# EAGLE design Relaya_the second Version 2 (EAGLE 9.1.2)
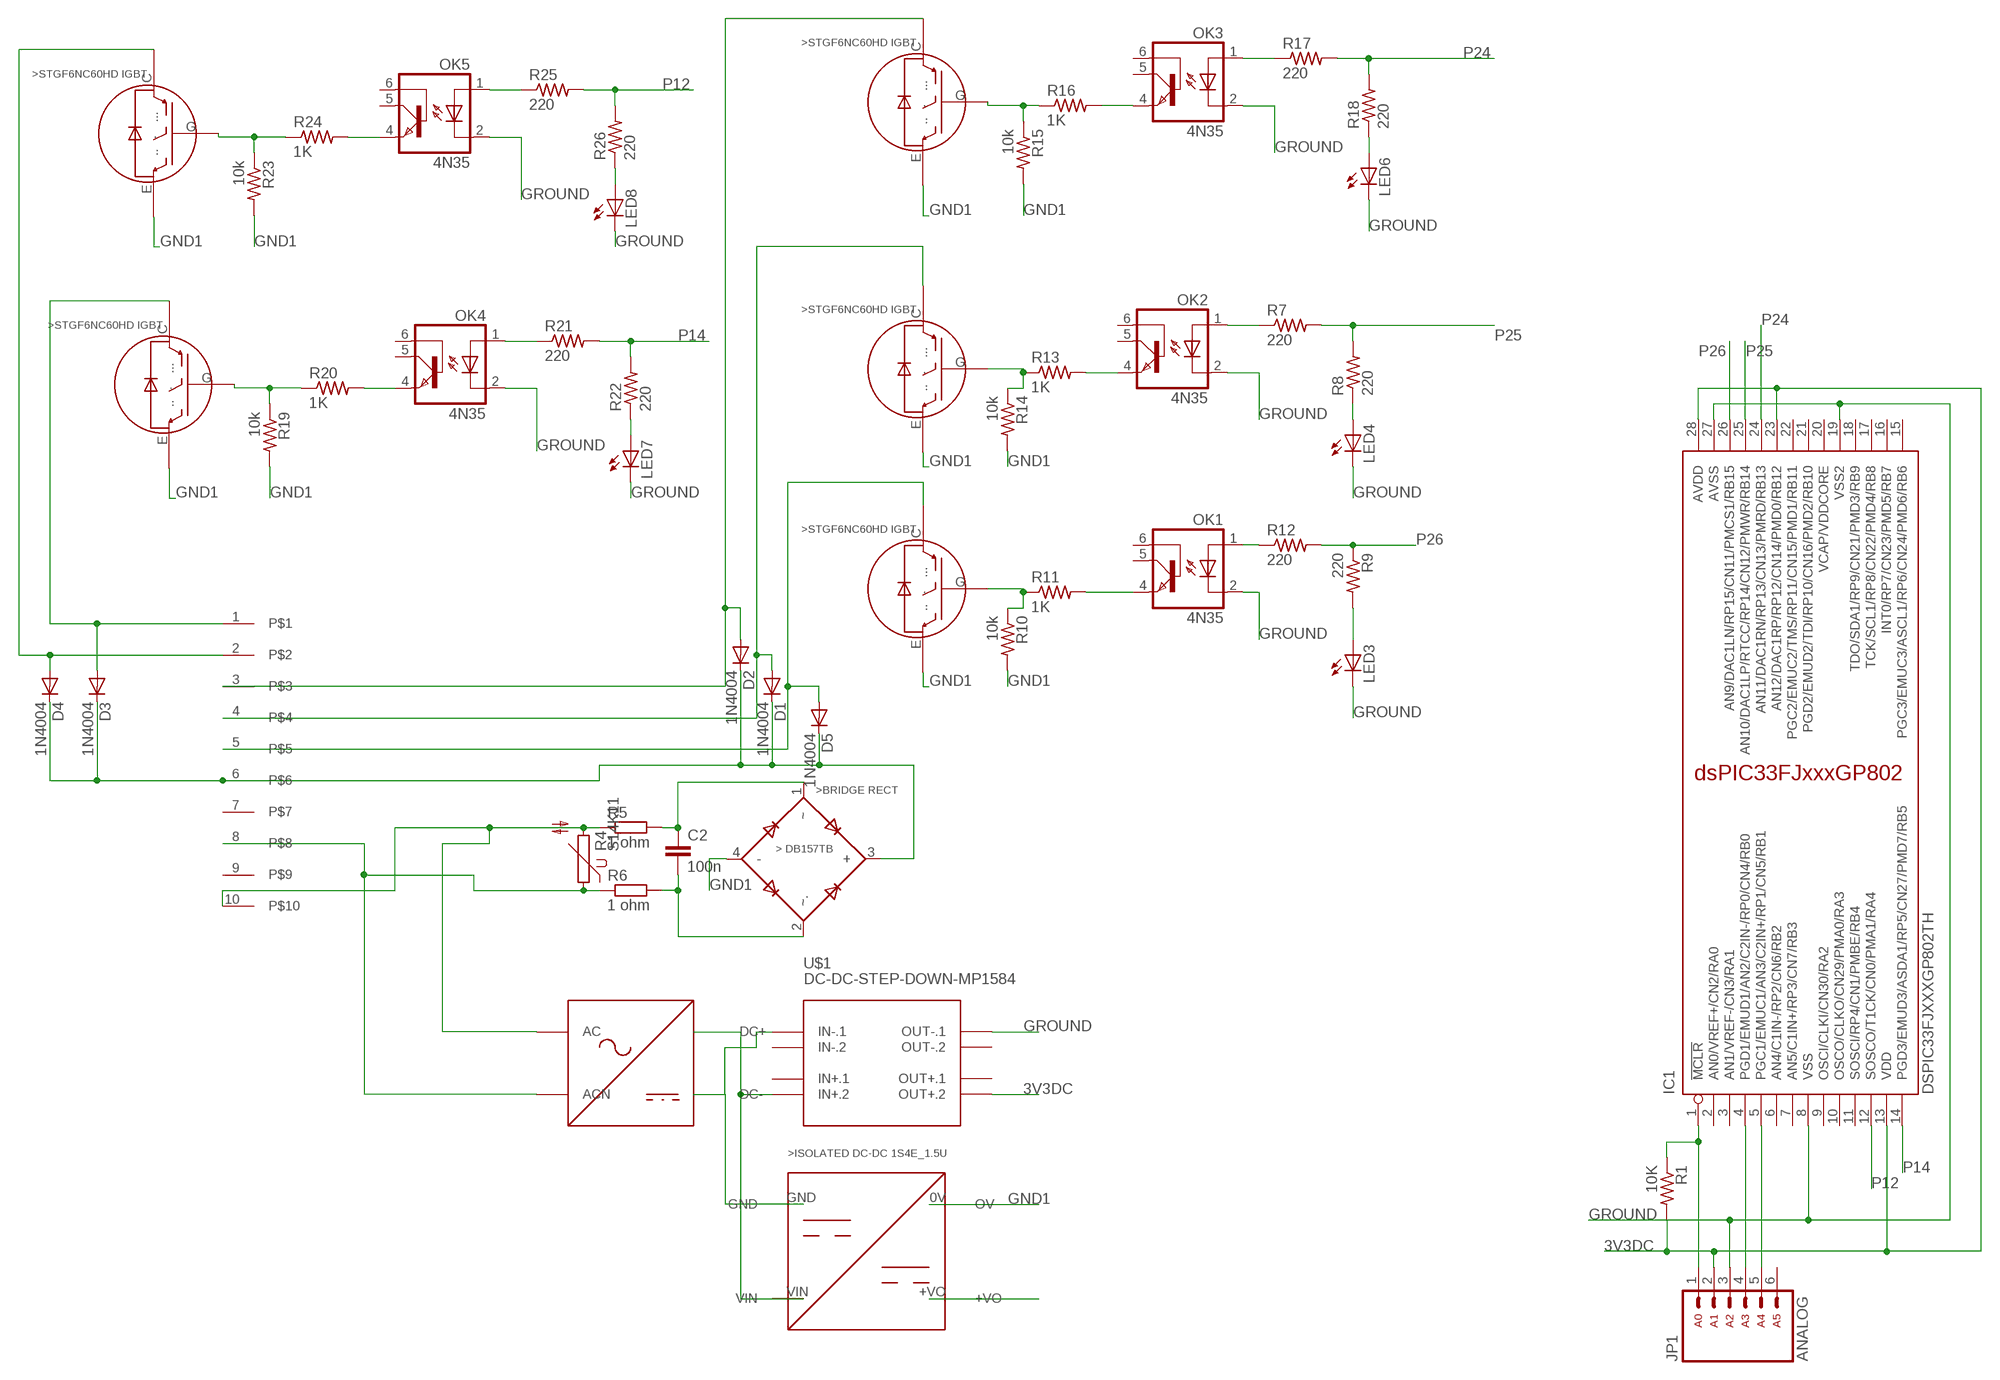
[diagram p0: schematic, sheet 1]

## Parts
ASD1  MY_LIBRAY_RPD10W1S  [MY_LIBRAY_2343]
C2  100n  C10/5  [C10B5]
D1  1N4004  [DO41-10]
D2  1N4004  [DO41-10]
D3  1N4004  [DO41-10]
D4  1N4004  [DO41-10]
D5  1N4004  [DO41-10]
IC1  DSPIC33FJXXXGP802TH  [DIL28-3]
JP1  ARDUINO_CONN-ANALOGSIP  [CONN-1X06]
LED3  LED5MM  [LED5MM]
LED4  LED5MM  [LED5MM]
LED6  LED5MM  [LED5MM]
LED7  LED5MM  [LED5MM]
LED8  LED5MM  [LED5MM]
OK1  4N35  [DIL06]
OK2  4N35  [DIL06]
OK3  4N35  [DIL06]
OK4  4N35  [DIL06]
OK5  4N35  [DIL06]
R1  10K  R-US_0207/10  [0207/10]
R4  S14K11  [S14K11]
R5  1 ohm  R-EU_0617/17  [0617/17]
R6  1 ohm  R-EU_0617/17  [0617/17]
R7  220  R-US_0207/10  [0207/10]
R8  220  R-US_0207/10  [0207/10]
R9  220  R-US_0207/10  [0207/10]
R10  10k  R-US_0207/10  [0207/10]
R11  1K  R-US_0207/10  [0207/10]
R12  220  R-US_0207/10  [0207/10]
R13  1K  R-US_0207/10  [0207/10]
R14  10k  R-US_0207/10  [0207/10]
R15  10k  R-US_0207/10  [0207/10]
R16  1K  R-US_0207/10  [0207/10]
R17  220  R-US_0207/10  [0207/10]
R18  220  R-US_0207/10  [0207/10]
R19  10k  R-US_0207/10  [0207/10]
R20  1K  R-US_0207/10  [0207/10]
R21  220  R-US_0207/10  [0207/10]
R22  220  R-US_0207/10  [0207/10]
R23  10k  R-US_0207/10  [0207/10]
R24  1K  R-US_0207/10  [0207/10]
R25  220  R-US_0207/10  [0207/10]
R26  220  R-US_0207/10  [0207/10]
U$1  DC-DC-STEP-DOWN-MP1584  [DC-DC-STEP-DOWN-MP1584]
U$2  AIRSEP_POWER_CONNECTOR  [JST-XH-CONNECTORS-GHII_JST-XH-10-PACKAGE-ROUND-PAD]
U$3  1S4E_1.5UA  [1S4E_1.5U]
U$4  IGBT_STGF6NC60HDA  [STGF6NC60HD]
U$5  BRIDGE_RECT_DB157TBA  [DB157TB]
U$6  IGBT_STGF6NC60HDA  [STGF6NC60HD]
U$7  IGBT_STGF6NC60HDA  [STGF6NC60HD]
U$8  IGBT_STGF6NC60HDA  [STGF6NC60HD]
U$9  IGBT_STGF6NC60HDA  [STGF6NC60HD]

## Nets
3V3DC [Power]: IC1.13(VDD) IC1.23(AN12/DAC1RP/RP12/CN14/PMD0/RB12) IC1.28(AVDD) JP1.2 R1.2 U$1.OUT+.2
AC__IN: ASD1.AC R4.2 R5.1 U$2.10
AC_IN: ASD1.ACN R4.1 R6.1 U$2.8
GND1 [Power]: R10.2 R14.2 R15.2 R19.2 R23.2 U$3.0V(OV) U$4.E(..) U$5.4(-) U$6.E(..) U$7.E(..) U$8.E(..) U$9.E(..)
GROUND [Power]: IC1.8(VSS) IC1.19(VSS2) IC1.27(AVSS) JP1.3 LED3.K(C) LED4.K(C) LED6.K(C) LED7.K(C) LED8.K(C) OK1.2(C) OK2.2(C) OK3.2(C) OK4.2(C) OK5.2(C) U$1.OUT-.1
N$1 [Power]: U$3.+VO
N$3 [Power]: OK1.4(EMI) R11.2
N$4 [Power]: C2.1 R5.2 U$5.1(~)
N$5 [Power]: C2.2 R6.2 U$5.2(~.)
N$6 [Power]: R10.1 R11.1 U$4.G(.)
N$7 [Power]: OK1.1(A) R12.1
N$9 [Power]: LED3.A R9.2
N$10 [Power]: R13.1 R14.1 U$6.G(.)
N$11 [Power]: OK2.1(A) R7.1
N$12 [Power]: OK2.4(EMI) R13.2
N$15 [Power]: LED4.A R8.1
N$16 [Power]: OK3.4(EMI) R16.2
N$17 [Power]: R15.1 R16.1 U$7.G(.)
N$18 [Power]: R19.1 R20.1 U$8.G(.)
N$19 [Power]: OK3.1(A) R17.1
N$21 [Power]: LED6.A R18.1
N$22 [Power]: OK4.4(EMI) R20.2
N$23 [Power]: OK4.1(A) R21.1
N$25 [Power]: LED7.A R22.1
N$26 [Power]: R23.1 R24.1 U$9.G(.)
N$27 [Power]: OK5.4(EMI) R24.2
N$28 [Power]: OK5.1(A) R25.1
N$30 [Power]: LED8.A R26.1
N$31 [Power]: D3.A U$2.1 U$8.C(...)
N$32 [Power]: ASD1.DC+ U$1.IN+.2 U$3.VIN
N$33 [Power]: ASD1.DC- U$1.IN-.1 U$3.GND
N$34 [Power]: D4.A U$2.2 U$9.C(...)
N$35 [Power]: D2.A U$2.3 U$7.C(...)
N$36 [Power]: D1.A U$2.4 U$6.C(...)
N$37 [Power]: D5.A U$2.5 U$4.C(...)
N$38 [Power]: D1.C D2.C D3.C D4.C D5.C U$2.6 U$5.3(+)
N$39 [Power]: IC1.5(PGC1/EMUC1/AN3/C2IN+/RP1/CN5/RB1) JP1.5
N$40 [Power]: IC1.4(PGD1/EMUD1/AN2/C2IN-/RP0/CN4/RB0) JP1.4
N$41 [Power]: IC1.1(!MCLR) JP1.1 R1.1
P12 [Power]: IC1.12(SOSCO/T1CK/CN0/PMA1/RA4) R25.2 R26.2
P14 [Power]: IC1.14(PGD3/EMUD3/ASDA1/RP5/CN27/PMD7/RB5) R21.2 R22.2
P24 [Power]: IC1.24(AN11/DAC1RN/RP13/CN13/PMRD/RB13) R17.2 R18.2
P25 [Power]: IC1.25(AN10/DAC1LP/RTCC/RP14/CN12/PMWR/RB14) R7.2 R8.2
P26 [Power]: IC1.26(AN9/DAC1LN/RP15/CN11/PMCS1/RB15) R9.1 R12.2
Unconnected: IC1.2(AN0/VREF+/CN2/RA0) IC1.3(AN1/VREF-/CN3/RA1) IC1.6(AN4/C1IN-/RP2/CN6/RB2) IC1.7(AN5/C1IN+/RP3/CN7/RB3) IC1.9(OSCI/CLKI/CN30/RA2) IC1.10(OSCO/CLKO/CN29/PMA0/RA3) IC1.11(SOSCI/RP4/CN1/PMBE/RB4) IC1.15(PGC3/EMUC3/ASCL1/RP6/CN24/PMD6/RB6) IC1.16(INT0/RP7/CN23/PMD5/RB7) IC1.17(TCK/SCL1/RP8/CN22/PMD4/RB8) IC1.18(TDO/SDA1/RP9/CN21/PMD3/RB9) IC1.21(PGD2/EMUD2/TDI/RP10/CN16/PMD2/RB10) IC1.22(PGC2/EMUC2/TMS/RP11/CN15/PMD1/RB11) JP1.6 OK1.5(COL) OK1.6(BAS) OK2.5(COL) OK2.6(BAS) OK3.5(COL) OK3.6(BAS) OK4.5(COL) OK4.6(BAS) OK5.5(COL) OK5.6(BAS) U$1.IN+.1 U$1.IN-.2 U$1.OUT+.1 U$1.OUT-.2 U$2.7 U$2.9

## Power pins joined to a net without a drawn wire
VCAP/VDDCORE: IC1.20(VCAP/VDDCORE)

## Library data of the parts
ASD1 = ACDC:MY_LIBRAY_RPD10W1S
C2 = capacitor-wima:C: CAPACITOR naming: grid - package width
D1-D5 = adafruit:1N4004: DIODE General purpose 1N400x type rectifier (With bigger pads) http://www.ladyada.net/library/pcb/eaglelibrary.html
IC1 = microchip-dspic33:DSPIC33FJXXXGP802: High-Performance, 16-bit Digital Signal Controllers - dsPIC33FJ64GP802 & dsPIC33FJ128GP802 Source: http://ww1.microchip.com/downloads/en/DeviceDoc/70292B.pdf Operating Range: . Up to 40 MIPS operation (at 3.0-3.6V): - Industrial temperature range (-40°C to +85°C) - Extended temperature range (-40°C to +125°C) High-Performance DSC CPU: . Modified Harvard architecture . C compiler optimized instruction set . 16-bit wide data path . 24-bit wide instructions . Linear program memory addressing up to 4M instruction words . Linear data memory addressing up to 64 Kbytes . 83 base instructions: mostly 1 word/1 cycle . Two 40-bit accumulators with rounding and saturation options . Flexible and powerful addressing modes: - Indirect - Modulo - Bit-Reversed . Software stack . 16 x 16 fractional/integer multiply operations . 32/16 and 16/16 divide operations . Single-cycle multiply and accumulate: - Accumulator write back for DSP operations - Dual data fetch . Up to ±16-bit shifts for up to 40-bit data On-Chip Flash and SRAM: . Flash program memory . Data SRAM . Boot, Secure, and General Security for program Flash Direct Memory Access (DMA): . 8-channel hardware DMA . Up to 2 Kbytes dual ported DMA buffer area (DMA RAM) to store data transferred via DMA: - Allows data transfer between RAM and a peripheral while CPU is executing code (no cycle stealing) . Most peripherals support DMA Timers/Capture/Compare/PWM: . Timer/Counters, up to five 16-bit timers: - Can pair up to make two 32-bit timers - One timer runs as a Real-Time Clock with an external 32.768 kHz oscillator - Programmable prescaler . Input Capture (up to four channels): - Capture on up, down or both edges - 16-bit capture input functions - 4-deep FIFO on each capture . Output Compare (up to four channels): - Single or Dual 16-bit Compare mode - 16-bit Glitchless PWM mode . Hardware Real-Time Clock/Calendar (RTCC): - Provides clock, calendar, and alarm functions Interrupt Controller: . 5-cycle latency . 118 interrupt vectors . Up to 49 available interrupt sources . Up to three external interrupts . Seven programmable priority levels . Five processor exceptions Digital I/O: . Peripheral pin Select functionality . Up to 35 programmable digital I/O pins . Wake-up/Interrupt-on-Change for up to 21 pins . Output pins can drive from 3.0V to 3.6V . Up to 5V output with open drain configuration . All digital input pins are 5V tolerant . 4 mA sink on all I/O pins System Management: . Flexible clock options: - External, crystal, resonator, internal RC - Fully integrated Phase-Locked Loop (PLL) - Extremely low jitter PLL . Power-up Timer . Oscillator Start-up Timer/Stabilizer . Watchdog Timer with its own RC oscillator . Fail-Safe Clock Monitor . Reset by multiple sources Power Management: . On-chip 2.5V voltage regulator . Switch between clock sources in real time . Idle, Sleep, and Doze modes with fast wake-up Analog-to-Digital Converters (ADCs): . 10-bit, 1.1 Msps or 12-bit, 500 Ksps conversion: - Two and four simultaneous samples (10-bit ADC) - Up to 13 input channels with auto-scanning - Conversion start can be manual or synchronized with one of four trigger sources - Conversion possible in Sleep mode - ±2 LSb max integral nonlinearity - ±1 LSb max differential nonlinearity Audio Digital-to-Analog Converter (DAC): . 16-bit Dual Channel DAC module . 100 Ksps maximum sampling rate . Second-Order Digital Delta-Sigma Modulator Data Converter Interface (DCI) module: . Codec interface . Supports I2S and AC.97 protocols . Up to 16-bit data words, up to 16 words per frame . 4-word deep TX and RX buffers Comparator Module: . Two analog comparators with programmable input/output configuration CMOS Flash Technology: . Low-power, high-speed Flash technology . Fully static design . 3.3V (±10%) operating voltage . Industrial and Extended temperature . Low power consumption Communication Modules: . 4-wire SPI (up to two modules): - Framing supports I/O interface to simple codecs - Supports 8-bit and 16-bit data - Supports all serial clock formats and sampling modes . I2C?: - Full Multi-Master Slave mode support - 7-bit and 10-bit addressing - Bus collision detection and arbitration - Integrated signal conditioning - Slave address masking . UART (up to two modules): - Interrupt on address bit detect - Interrupt on UART error - Wake-up on Start bit from Sleep mode - 4-character TX and RX FIFO buffers - LIN bus support - IrDA® encoding and decoding in hardware - High-Speed Baud mode - Hardware Flow Control with CTS and RTS . Enhanced CAN (ECAN. module) 2.0B active: - Up to eight transmit and up to 32 receive buffers - 16 receive filters and three masks - Loopback, Listen Only and Listen All - Messages modes for diagnostics and bus monitoring - Wake-up on CAN message - Automatic processing of Remote Transmission Requests - FIFO mode using DMA - DeviceNet. addressing support . Parallel Master Slave Port (PMP/EPSP): - Supports 8-bit or 16-bit data - Supports 16 address lines . Programmable Cyclic Redundancy Check (CRC): - Programmable bit length for the CRC generator polynomial (up to 16-bit length) - 8-deep, 16-bit or 16-deep, 8-bit FIFO for data input
JP1 = arduino_jw:ARDUINO_CONN-ANALOG: Arduino Analog I/O Header This is the analog I/O header on the Arduino Uno R3. This connector is labeled with the following pin assignments: Analog 0 Analog 1 Analog 2 Analog 3 Analog 4 Analog 5 NOTE: Be sure you install this connector with the correct orientation on your PCB layout. Pin 1 has a square pad to assist with orientation.
LED3 LED4 LED6-LED8 = led:LED: LED OSRAM: - CHIPLED LG R971, LG N971, LY N971, LG Q971, LY Q971, LO R971, LY R971 LH N974, LH R974 LS Q976, LO Q976, LY Q976 LO Q996 - Hyper CHIPLED LW Q18S LB Q993, LB Q99A, LB R99A - SideLED LS A670, LO A670, LY A670, LG A670, LP A670 LB A673, LV A673, LT A673, LW A673 LH A674 LY A675 LS A676, LA A676, LO A676, LY A676, LW A676 LS A679, LY A679, LG A679 - Hyper Micro SIDELED® LS Y876, LA Y876, LO Y876, LY Y876 LT Y87S - SmartLED LW L88C, LW L88S LB L89C, LB L89S, LG L890 LS L89K, LO L89K, LY L89K LS L896, LA L896, LO L896, LY L896 - TOPLED LS T670, LO T670, LY T670, LG T670, LP T670 LSG T670, LSP T670, LSY T670, LOP T670, LYG T670 LG T671, LOG T671, LSG T671 LB T673, LV T673, LT T673, LW T673 LH T674 LS T676, LA T676, LO T676, LY T676, LB T676, LH T676, LSB T676, LW T676 LB T67C, LV T67C, LT T67C, LS T67K, LO T67K, LY T67K, LW E67C LS E67B, LA E67B, LO E67B, LY E67B, LB E67C, LV E67C, LT E67C LW T67C LS T679, LY T679, LG T679 LS T770, LO T770, LY T770, LG T770, LP T770 LB T773, LV T773, LT T773, LW T773 LH T774 LS E675, LA E675, LY E675, LS T675 LS T776, LA T776, LO T776, LY T776, LB T776 LHGB T686 LT T68C, LB T68C - Hyper Mini TOPLED® LB M676 - Mini TOPLED Santana® LG M470 LS M47K, LO M47K, LY M47K Source: http://www.osram.convergy.de LUXEON: - LUMILED® LXK2-PW12-R00, LXK2-PW12-S00, LXK2-PW14-U00, LXK2-PW14-V00 LXK2-PM12-R00, LXK2-PM12-S00, LXK2-PM14-U00 LXK2-PE12-Q00, LXK2-PE12-R00, LXK2-PE12-S00, LXK2-PE14-T00, LXK2-PE14-U00 LXK2-PB12-K00, LXK2-PB12-L00, LXK2-PB12-M00, LXK2-PB14-N00, LXK2-PB14-P00, LXK2-PB14-Q00 LXK2-PR12-L00, LXK2-PR12-M00, LXK2-PR14-Q00, LXK2-PR14-R00 LXK2-PD12-Q00, LXK2-PD12-R00, LXK2-PD12-S00 LXK2-PH12-R00, LXK2-PH12-S00 LXK2-PL12-P00, LXK2-PL12-Q00, LXK2-PL12-R00 Source: www.luxeon.com KINGBRIGHT: KA-3528ASYC Source: www.kingbright.com
OK1-OK5 = optocoupler:4N35: MOTOROLA OPTO COUPLER; MF: FAIRCHILD SEMICONDUCTOR; MPN: 4N35; OC_FARNELL: 1328375; OC_NEWARK: 72K9946
R1 R7-R26 = resistor:R-US_: RESISTOR, American symbol
R4 = varistor:S14K11: VARISTOR
R5 R6 = rcl:R-EU_: RESISTOR, European symbol; SPICEPREFIX: R
U$1 = GHIdiy-modules:DC-DC-STEP-DOWN-MP1584: DC/DC Step-Down Regulator based on MP1584 chip MP1584 datasheet available here: http://www.haoyuelectronics.com/Attachment/MP1584/MP1584.pdf Click here to find device on ebay.com <http://www.ebay.com/sch/mp1584+module>
U$2 = Airsep_Power_Connector:AIRSEP_POWER_CONNECTOR
U$3 = GHII Isolated dc-dc 1S4E_1.5U:1S4E_1.5U
U$4 U$6-U$9 = GHII IGBT GF6NC60HD:IGBT_STGF6NC60HD: GHII IGBT
U$5 = BRIDGE RECTIFIER (DB157TB):BRIDGE_RECT_DB157TB

## Net classes
0 default: width 3 mm, drill 3 mm, clearance 0.762 mm
1 Power: width 1.3 mm, drill 1.3 mm, clearance 0.508 mm

## Board
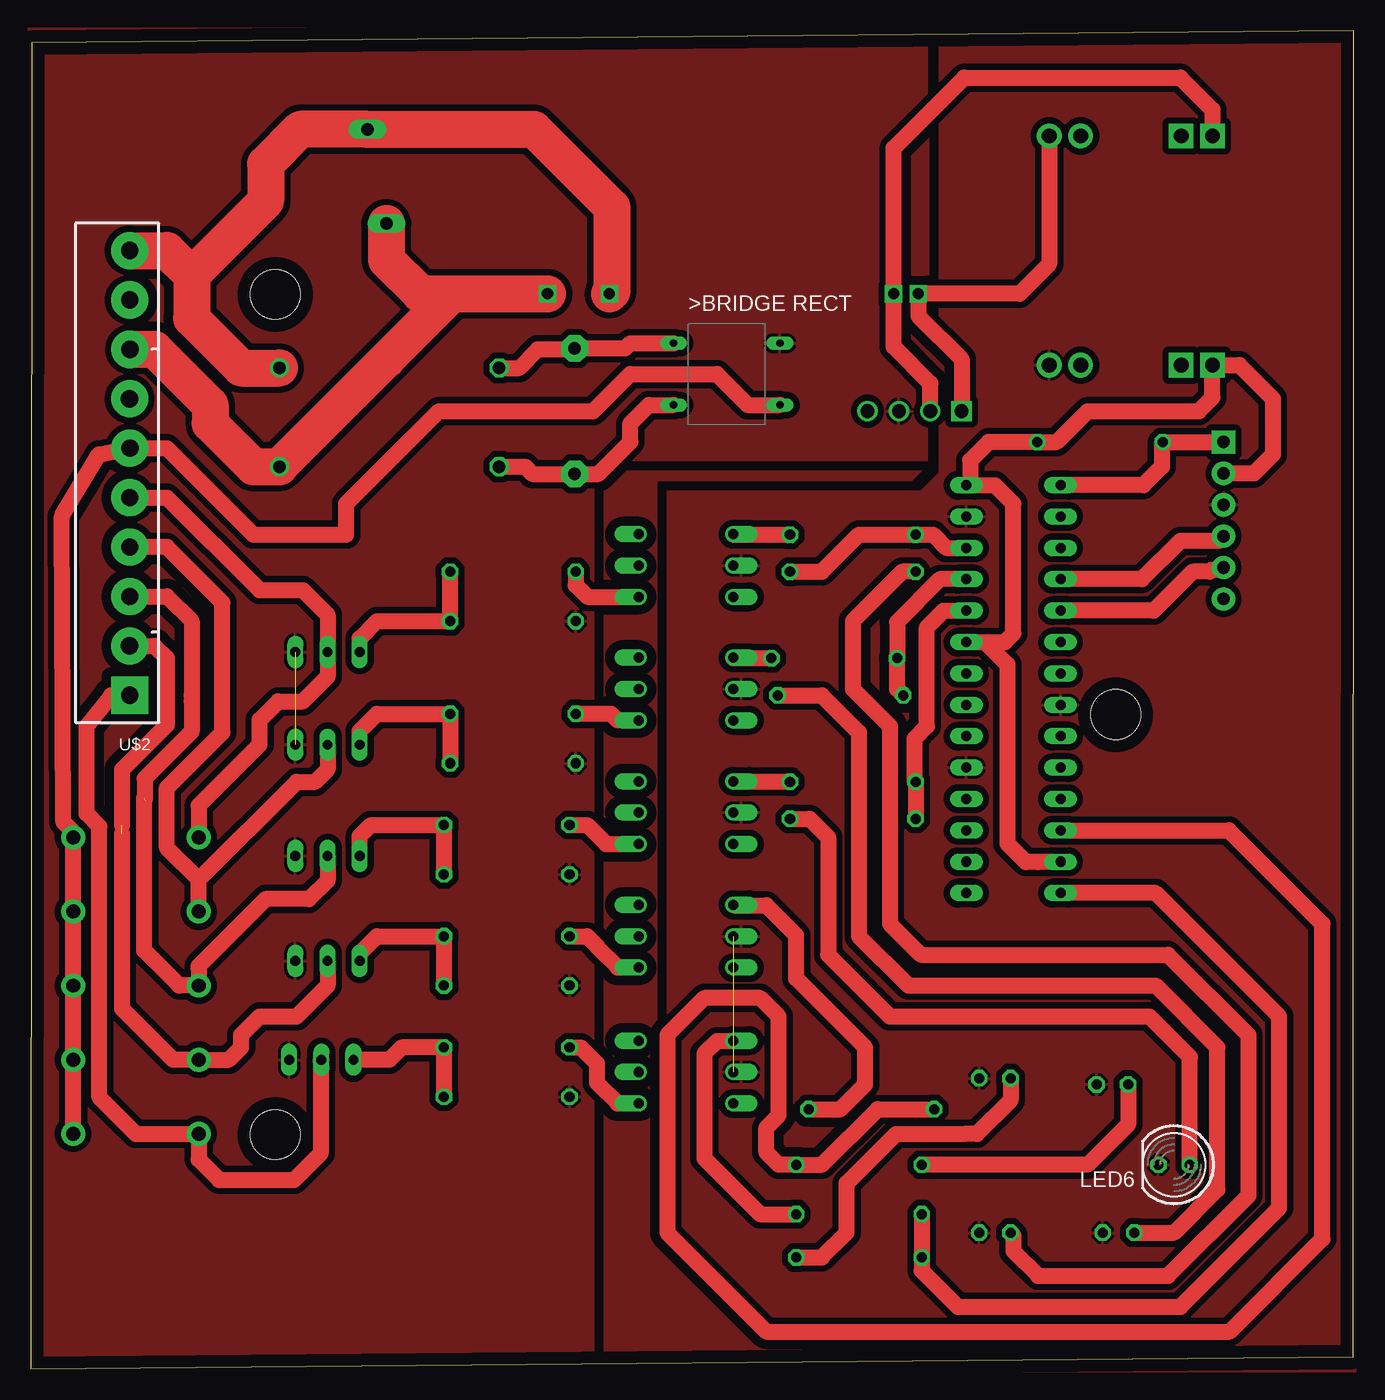
[diagram p1: board, top side]
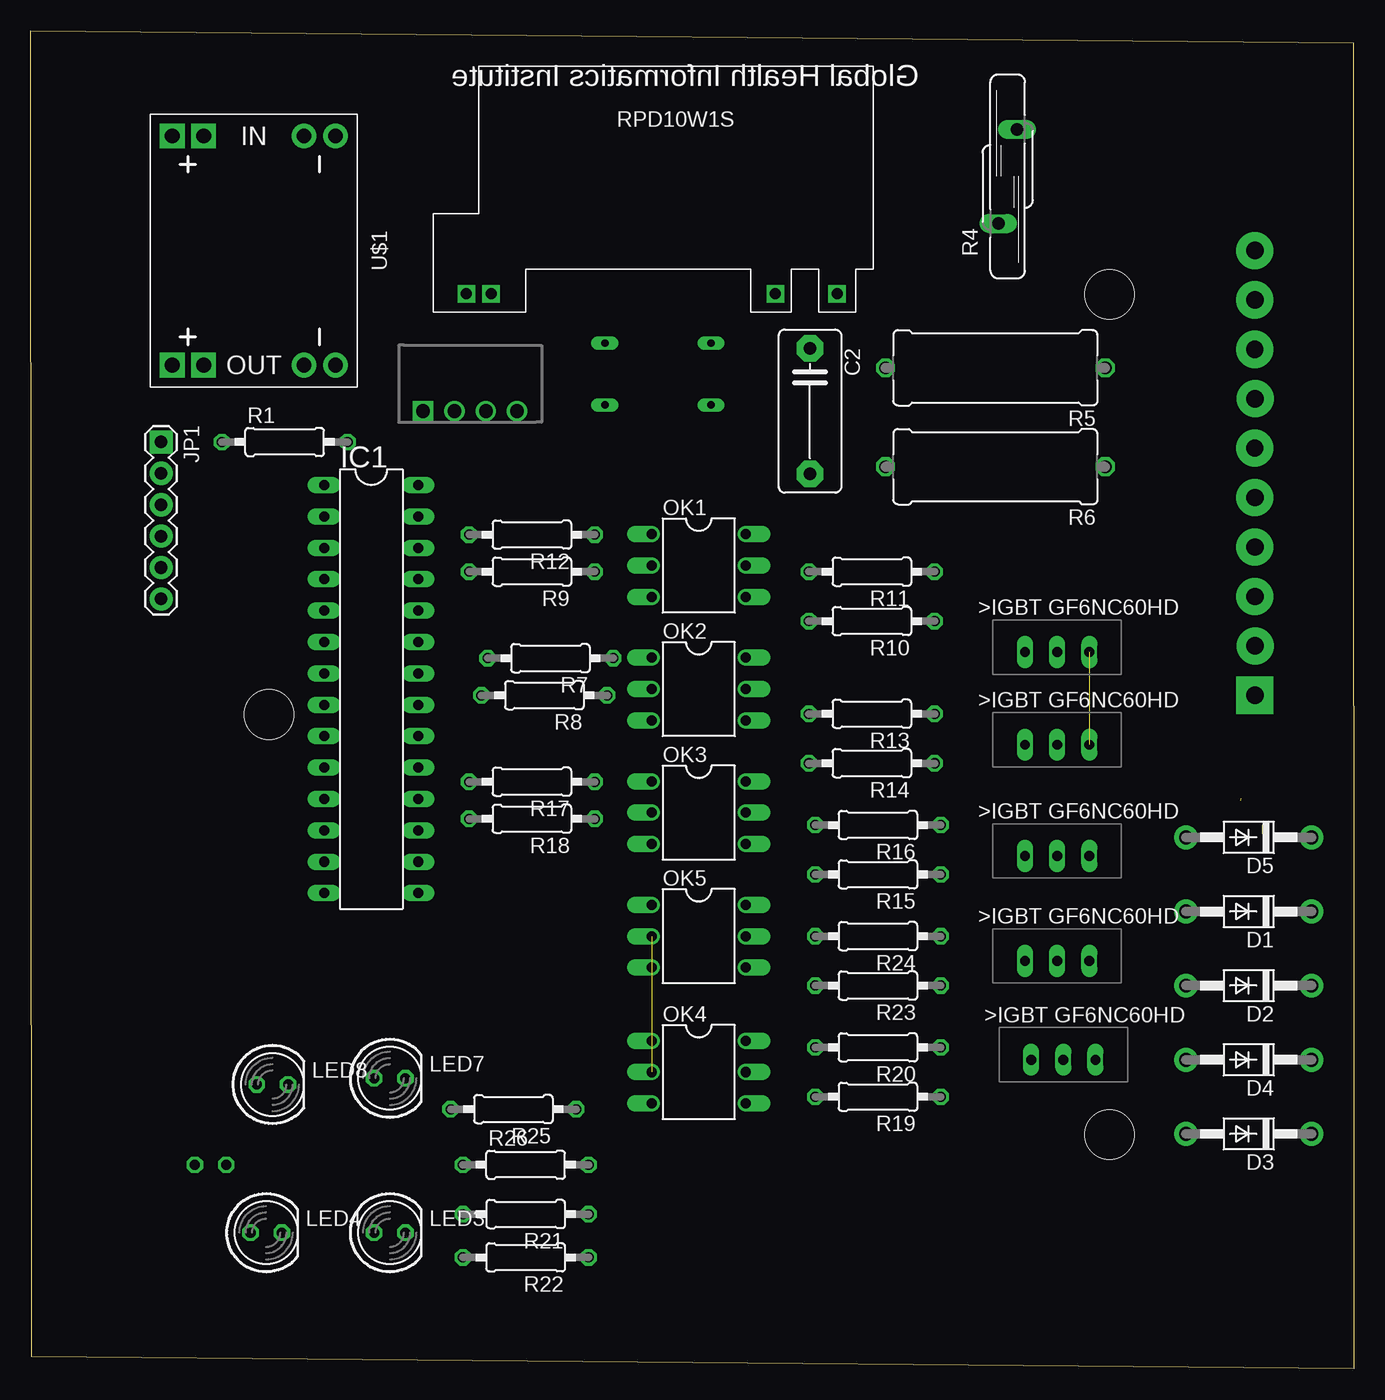
[diagram p2: board, bottom side, seen from below]

Size 107.04 x 108.28 mm. Coordinates in mm from the lower left corner, seen from the top.
Outline: 0,0 106.99,0.96 107.04,108.28 0.05,107.32 0,0
Copper layers (1*16): Top 0.035mm / dielectric 1.5mm / Bottom 0.035mm
Design rules "default": minimum track width 6mil, minimum drill 0.35mm, track to track 6mil, track to pad 6mil, pad to pad 6mil, via to via 6mil, smd to smd 6mil, copper to edge 40mil, drill to drill 6mil, minimum pad ring 10mil, minimum via ring 8mil, stop-mask expansion 4mil, vias tented up to drill 0mil, thermal gap 10mil
Holes 4 mm at 87.77,52.94 19.77,86.94 19.77,18.94

### Footprints (pad centres in the part's own frame; a part is rotated, then mirrored left to right if it is on the bottom)
MY_LIBRAY_2343 = drill 0.9 square: AC 2.7,-13.5; ACN 7.7,-13.5; DC+ -20.3,-13.5; DC- -22.3,-13.5
C10B5 = drill 1.016 pad 2.159 octagon: 1 -5.08,0; 2 5.08,0
DO41-10 = drill 1.118 pad 1.93: A 5.08,0; C -5.08,0
DIL28-3 = drill 0.813 long: 1 -16.51,-3.81; 2 -13.97,-3.81; 3 -11.43,-3.81; 4 -8.89,-3.81; 5 -6.35,-3.81; 6 -3.81,-3.81; 7 -1.27,-3.81; 8 1.27,-3.81; 9 3.81,-3.81; 10 6.35,-3.81; 11 8.89,-3.81; 12 11.43,-3.81; 13 13.97,-3.81; 14 16.51,-3.81; 15 16.51,3.81; 16 13.97,3.81; 17 11.43,3.81; 18 8.89,3.81; 19 6.35,3.81; 20 3.81,3.81; 21 1.27,3.81; 22 -1.27,3.81; 23 -3.81,3.81; 24 -6.35,3.81; 25 -8.89,3.81; 26 -11.43,3.81; 27 -13.97,3.81; 28 -16.51,3.81
CONN-1X06 = drill 1.016 pad 1.88 square: 1 0,0 | drill 1.016 pad 1.88: 2 2.54,0; 3 5.08,0; 4 7.62,0; 5 10.16,0; 6 12.7,0
LED5MM = drill 0.813 octagon: A -1.27,0; K 1.27,0
DIL06 = drill 0.813 offset: 1 -2.54,-3.81; 2 0,-3.81; 3 2.54,-3.81; 4 2.54,3.81; 5 0,3.81; 6 -2.54,3.81
0207/10 = drill 0.813 octagon: 1 -5.08,0; 2 5.08,0
S14K11 = drill 1.016 long: 1 -0.762,-3.81; 2 0.762,3.81
0617/17 = drill 1.016 octagon: 1 -8.89,0; 2 8.89,0
DC-DC-STEP-DOWN-MP1584 = drill 1.2 pad 2 square: IN+.1 -9.271,-4.064; IN+.2 -9.271,-6.604; OUT+.1 9.271,-4.064; OUT+.2 9.271,-6.604 | drill 1.2 pad 2: IN-.1 -9.271,6.604; IN-.2 -9.271,4.064; OUT-.1 9.271,6.604; OUT-.2 9.271,4.064
JST-XH-CONNECTORS-GHII_JST-XH-10-PACKAGE-ROUND-PAD = drill 1.4 pad 3 square: 1 -18.5,0 | drill 1.4 pad 3: 2 -14.5,0.01; 3 -10.5,0; 4 -6.5,0; 5 -2.5,0; 6 1.5,-0.01; 7 5.5,0.01; 8 9.5,-0.01; 9 13.5,0; 10 17.5,0
1S4E_1.5U = drill 1.1: 0V 1.27,0; +VO 3.81,0; VIN -1.27,0 | drill 1.1 square: GND -3.81,0
STGF6NC60HD = drill 0.8 long: C 0,0; E 2.6,0; G -2.6,0
DB157TB = drill 0.6 long: 1 0,0; 2 5,0; 3 5,8.6; 4 0,8.6

### Placement (x,y rotation side)
ASD1  49.5,100.5 0 bottom
C2  44,77.5 270 bottom
D1  8.5,37 180 bottom
D2  8.5,31 180 bottom
D3  8.5,19 180 bottom
D4  8.5,25 180 bottom
D5  8.5,43 180 bottom
IC1  79.5,55 270 bottom
JP1  96.5,75 270 bottom
LED3  78,11 0 bottom
LED4  88,11 0 bottom
LED6  92.5,16.5 180 top
LED7  78,23.5 0 bottom
LED8  87.5,23 0 bottom
OK1  53,65 270 bottom
OK2  53,55 270 bottom
OK3  53,45 270 bottom
OK4  53,24 270 bottom
OK5  53,35 270 bottom
R1  86.5,75 0 bottom
R4  28,96.5 0 bottom
R5  29,81 180 bottom
R6  29,73 180 bottom
R7  65,57.5 180 bottom
R8  65.5,54.5 180 bottom
R9  66.5,64.5 180 bottom
R10  39,60.5 180 bottom
R11  39,64.5 180 bottom
R12  66.5,67.5 180 bottom
R13  39,53 180 bottom
R14  39,49 180 bottom
R15  38.5,40 180 bottom
R16  38.5,44 180 bottom
R17  66.5,47.5 180 bottom
R18  66.5,44.5 180 bottom
R19  38.5,22 180 bottom
R20  38.5,26 180 bottom
R21  67,12.5 180 bottom
R22  67,9 180 bottom
R23  38.5,31 180 bottom
R24  38.5,35 180 bottom
R25  68,21 180 bottom
R26  67,16.5 0 bottom
U$1  89,90.5 270 bottom
U$2  8,73 90 top
U$3  71.5,77.5 0 bottom
U$4  24,58 0 bottom
U$5  52,83 270 top
U$6  24,50.5 0 bottom
U$7  24,41.5 0 bottom
U$8  23.5,25 0 bottom
U$9  24,33 0 bottom

### Tracks (layer width: path | path; a pad name or v marks a point on that pad's centre or on a via)
3V3DC
  Top 1.3: JP1.2 98.96,72.46 100.5,74 100.5,78.5 97.77,81.23 U$1.OUT+.2 95.6,78.6 94.5,77.5 85.5,77.5 83,75 R1.2 77.5,75 76,73.5 76,71.82 IC1.28 78,71.5 79.5,70 79.5,59.5 78.81,58.81 77.19,58.81 | IC1.13 81.53,41.03 81.5,41 80.5,41 79,42.5 79,57 77.19,58.81 | IC1.23 77.19,58.81
_OUTLINES_
  pour Top (isolate 0.025, rank 6): -0.27,-0.27 107.23,-0.27 107.23,108.47 -0.27,108.47
AC__IN
  Top 3: U$2.10 11,90.5 13,88.5 | 13,88.5 13,85 17,81 R5.1 | 13,88.5 19,94.5 19,97.5 21.81,100.31 R4.2 40.69,100.31 47,94 47,87.2 ASD1.AC
AC_IN
  Top 3: U$2.8 10,82.5 14.5,78 14.5,76.5 18,73 R6.1 28.76,81.65 34.11,87 | 34.11,87 ASD1.ACN | R4.1 28.76,89.74 31.5,87 34.11,87
GND1  (1 unrouted)
  pour Top: 0,108 72.5,108 72.5,73.5 45.5,73.5 45.5,0 0,0
GROUND  (1 unrouted)
  pour Top: 73.5,107.5 73.5,72.5 72,71 51.5,71 51.5,1.5 106.5,1.5 106.5,108 73.5,108
N$3
  Top 1.3: R11.2 44.08,63.42 45.04,62.46 OK1.4
N$4
  Top 1.3: R5.2 39.5,81 41,82.5 43.92,82.5 C2.1 48.08,82.58 48.5,83 U$5.1
N$5
  Top 1.3: R6.2 40,73 40.58,72.42 C2.2 45.92,72.42 48.5,75 48.5,76.5 50,78 U$5.2
N$6
  Top 1.3: U$4.G 26.6,59.1 28,60.5 R10.1 R11.1
N$7
  Top 1.3: OK1.1 56.85,67.5 R12.1
N$9
  Top 1.3: R9.2 70.5,64.5 66.5,60.5 66.5,55 69.5,52 69.5,36 72,33.5 92,33.5 98.5,27 98.5,14 92,7.5 81.5,7.5 79.5,9.5 79.5,10.77 LED3.A
N$10
  Top 1.3: U$6.G 26.6,51.6 28,53 R13.1 R14.1
N$11
  Top 1.3: OK2.1 56.85,57.5 R7.1
N$12
  Top 1.3: OK2.4 47.48,52.46 46.94,53 R13.2
N$15
  Top 1.3: R8.1 64,54.5 67,51.5 67,35 71,31 91,31 96,26 96,14.5 92.5,11 LED4.A
N$16
  Top 1.3: R16.2 45,44 46.54,42.46 OK3.4
N$17
  Top 1.3: U$7.G 26.6,43.1 27.5,44 R16.1 R15.1
N$18
  Top 1.3: U$8.G 29,25 30,26 R20.1 R19.1
N$19
  Top 1.3: OK3.1 61.38,47.54 R17.1
N$21
  Top 1.3: R18.1 63,44.5 64.5,43 64.5,33.5 69.5,28.5 75.94,28.5 76.5,28.5 90.5,28.5 93.77,25.23 LED6.A
N$22
  Top 1.3: R20.2 44.5,26 45.8,24.7 45.8,23.14 47.48,21.46 OK4.4
N$23
  Top 1.3: OK4.1 56.77,26.5 55.5,26.5 54.5,25.5 54.5,17 59,12.5 R21.1
N$25
  Top 1.3: R22.1 64,9 66,11 66,15 70,19 75.5,19 76.54,19 79.27,21.73 LED7.A
N$26
  Top 1.3: U$9.G 26.6,33.6 28,35 R24.1 R23.1
N$27
  Top 1.3: R24.2 45,35 45.8,34.2 45.8,34.14 47.48,32.46 OK5.4
N$28
  Top 1.3: OK5.1 56.85,37.5 59.5,37.5 61.92,35.08 61.92,31.58 67.5,26 67.5,23 65.5,21 R25.1
N$30
  Top 1.3: R26.1 85.5,16.5 88.77,19.77 LED8.A
N$31
  Top 1.3: U$2.1 6.5,54.5 4.5,52 4.5,44.92 5.54,43.88 5.54,21.96 8.5,19 D3.A 13.58,16.92 15.23,15.27 21.29,15.27 23.44,17.42 23.44,24.94 U$8.C
N$32
  Top 1.3: U$1.IN+.2 95.6,101.9 93,104.5 75.5,104.5 69.8,98.8 ASD1.DC+ 69.8,82.7 72.77,79.73 U$3.VIN
N$33
  Top 1.3: U$1.IN-.1 82.4,89.4 80,87 ASD1.DC- 71.8,85.2 75.31,81.69 U$3.GND
N$34  (1 unrouted)
  Top 1.3: 7.35,43.29 7.35,29.5 7.35,29.15 11.5,25 D4.A 16,25 17,26 17,27 18.5,28.5 21.5,28.5 24,31 U$9.C | U$2.2 10,58.5 11,57.5 11,52.11 7.35,48.47 7.35,44
N$35  (1 unrouted)
  Top 1.3: U$2.3 11,62.5 13,60.5 13,54.5 | 13,54.5 13,54 | 13.58,32.42 D2.A | U$7.C 24,39.5 22.5,38 19,38 13.58,32.58 D2.A | D2.A 12,31 9.16,33.84 9.16,46.16 | 13,54.5 13,51.56 9.19,47.75 9.19,46
N$36
  Top 1.3: U$6.C 24,48.5 23,47.5 21.5,47.5 13.58,39.58 | U$2.4 11,66.5 15.5,62 15.5,51.5 11,47 11,42.16 13.58,39.58 | D1.A 13.58,39.58
N$37
  Top 1.3: U$2.5 11,70.5 18.5,63 22,63 24,61 U$4.C 24,56 22,54 20,54 18.5,52.5 18.5,50.5 13.58,45.58 D5.A
N$38
  Top 1.3: U$5.3 58,78 55.5,80.5 48.5,80.5 45.5,77.5 33,77.5 25.5,70 25.5,67.5 18,67.5 11,74.5 U$2.6 5.5,74 2.5,69 2.62,44.24 3.42,43.45 D5.C D1.C D2.C D4.C D3.C
N$39
  Top 1.3: JP1.5 96.31,64.65 95.53,64.65 95.37,64.5 94,64.5 90.85,61.35 IC1.5
N$40
  Top 1.3: JP1.4 96.12,67 93,67 89.89,63.89 IC1.4
N$41
  Top 1.3: JP1.1 R1.1 91.5,74.92 91.5,73 90.01,71.51 IC1.1
P12
  Top 1.3: R25.2 68.5,21 64,16.5 R26.2 60.5,16.5 59.5,17.5 59.5,19.5 60.5,20.5 60.5,28.5 59,30 54.5,30 51.5,27 51.5,11 59.5,3 97,3 104.5,10.5 104.5,36 96.93,43.57 IC1.12
P14
  Top 1.3: R21.2 R22.2 72.08,7.92 75,5 93,5 101,13 101,28.5 91.01,38.49 IC1.14
P24
  Top 1.3: R18.2 R17.2 71.5,47.58 71.5,51 72.5,52 72.5,60 73.85,61.35 IC1.24
P25
  Top 1.3: IC1.25 73.54,63.89 70.08,60.43 R7.2 70.08,55 R8.2
P26
  Top 1.3: IC1.26 74.07,66.43 73,67.5 R12.2 67,67.5 64,64.5 R9.1

### Text on the board
bNames: Global Health Informatics Institute